# Altium schematic sheet sch_power.SchDoc
size A; SheetNumber: 1; SheetTotal: 1
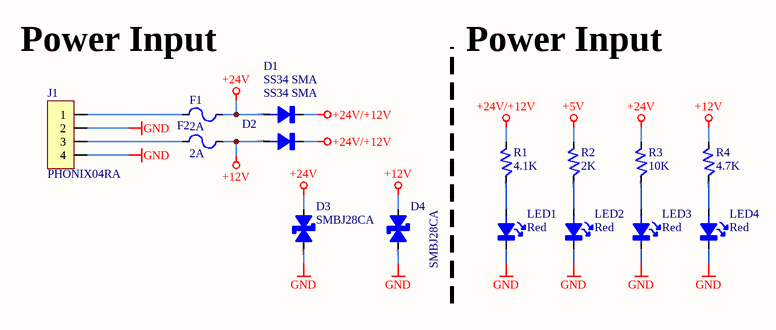
[diagram p0: sch_power.SchDoc]

## Parts
D1  SS34 SMA  [SMA_diode]
D2  SS34 SMA  [SMA_diode]
D3  SMBJ28CA  [DIODEthyristors]
D4  SMBJ28CA  [DIODEthyristors]
F1  2A  [1206]
F2  2A  [1206]
J1  PHONIX04RA  [TER4-R-3.81]
LED1  Red  [0805-d]
LED2  Red  [0805-d]
LED3  Red  [0805-d]
LED4  Red  [0805-d]
R1  4.1K  [0805]
R2  2K  [0805]
R3  10K  [0805]
R4  4.7K  [0805]

## Nets
+5V: R2.2
+12V: D2.A D4.K F2.1 R4.2
+24V: D1.A D3.K F1.1 R3.2
+24V/+12V: D1.K D2.K R1.2
GND: D3.A D4.A J1.2 J1.4 LED1.K LED2.K LED3.K LED4.K
NetF1_2: F1.2 J1.1
NetF2_2: F2.2 J1.3
NetLED1_A: LED1.A R1.1
NetLED2_A: LED2.A R2.1
NetLED3_A: LED3.A R3.1
NetLED4_A: LED4.A R4.1

## Notes on the sheet
- Power Input
- (in symbol D-DIODE) @DesignPCB
- (in symbol DIODE) @DesignPCB
- (in symbol FUSE) @DesignPCB
- (in symbol LED) @DesignPCB
- (in symbol RESISTOR) @DesignPCB

## Library data of the parts
D1 D2 = DIODE
D3 D4 = D-DIODE
F1 F2 = FUSE
J1 = CON4
LED1-LED4 = LED
R1-R4 = RESISTOR